# EAGLE design interface_gate (EAGLE 6.6.0)
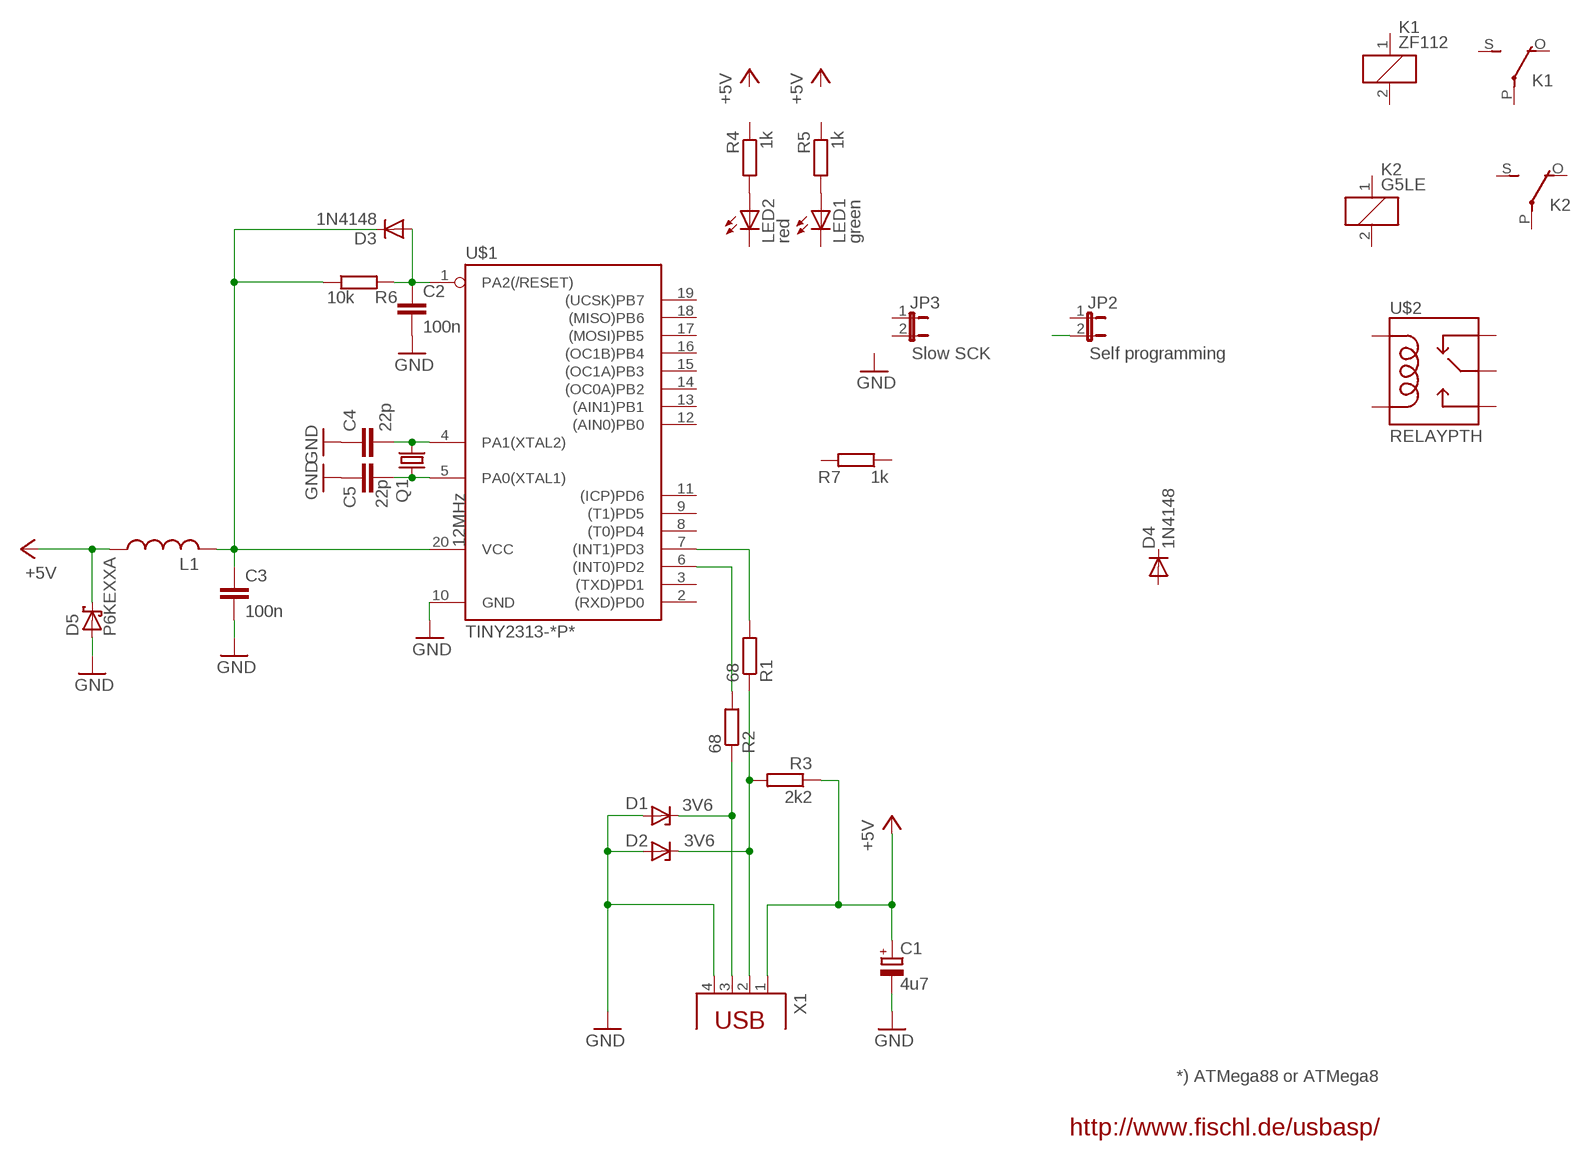
[diagram p0: schematic, sheet 1]

## Parts
C1  4u7  CPOL-EUE2.5-5  [E2,5-5]
C2  100n  C-EU025-024X044  [C025-024X044]
C3  100n  C-EU025-024X044  [C025-024X044]
C4  22p  C-EU025-024X044  [C025-024X044]
C5  22p  C-EU025-024X044  [C025-024X044]
D1  3V6  ZENER-DIODEDO34-7  [DO34Z7]
D2  3V6  ZENER-DIODEDO34-7  [DO34Z7]
D3  1N4148  1N4148DO35-10  [DO35-10]
D4  1N4148  1N4148DO35-10  [DO35-10]
D5  P6KEXXA  [C1702-15]
JP2  Self programming  JP1E  [JP1]
JP3  Slow SCK  JP1E  [JP1]
K1  ZF112  [ZF112]
K2  G5LE  [G5LE]
L1  L-US0207/10  [0207/10]
LED1  green  LED3MM  [LED3MM]
LED2  red  LED3MM  [LED3MM]
Q1  12MHz  CRYTALHC49S  [HC49/S]
R1  68  R-EU_0207/10  [0207/10]
R2  68  R-EU_0207/10  [0207/10]
R3  2k2  R-EU_0207/10  [0207/10]
R4  1k  R-EU_0207/10  [0207/10]
R5  1k  R-EU_0207/10  [0207/10]
R6  10k  R-EU_0207/10  [0207/10]
R7  1k  R-EU_0207/10  [0207/10]
U$1  TINY2313-*P*  [DIL20]
U$2  RELAYPTH  [SRD-05VDC-SL-C]
X1  PN61729  [PN61729]

## Nets
+5V: C1.+ D5.C L1.1 R3.1 X1.1
GND: C1.- C2.2 C3.2 C4.1 C5.1 D1.A D2.A D5.A U$1.10(GND) X1.4
N$1: C2.1 D3.A R6.2 U$1.1(PA2(/RESET))
N$3: C3.1 D3.C L1.2 R6.1 U$1.20(VCC)
N$5: D2.C R1.1 R3.2 X1.2
N$7: R2.2 U$1.6((INT0)PD2)
N$8: D1.C R2.1 X1.3
N$13: LED2.A R4.2
N$16: R1.2 U$1.7((INT1)PD3)
N$19: JP2.2
N$22: C4.2 Q1.2 U$1.4(PA1(XTAL2))
N$23: C5.2 Q1.1 U$1.5(PA0(XTAL1))
N$25: LED1.A R5.2
Unconnected: D4.A D4.C JP2.1 JP3.1 JP3.2 K1.1 K1.2 K1.O(2:O) K1.P(2:P) K1.S(2:S) K2.1 K2.2 K2.O(2:O) K2.P(2:P) K2.S(2:S) LED1.K(C) LED2.K(C) R4.1 R5.1 R7.1 R7.2 U$1.2((RXD)PD0) U$1.3((TXD)PD1) U$1.8((T0)PD4) U$1.9((T1)PD5) U$1.11((ICP)PD6) U$1.12((AIN0)PB0) U$1.13((AIN1)PB1) U$1.14((OC0A)PB2) U$1.15((OC1A)PB3) U$1.16((OC1B)PB4) U$1.17((MOSI)PB5) U$1.18((MISO)PB6) U$1.19((UCSK)PB7) U$2.COIL0 U$2.COIL1 U$2.SWCLOSED(SWCLOSE) U$2.SWCOMMON U$2.SWOPEN

## Notes on the sheet
- *) ATMega88 or ATMega8
- http://www.fischl.de/usbasp/

## Library data of the parts
C1 = rcl:CPOL-EU: POLARIZED CAPACITOR, European symbol
C2-C5 = rcl:C-EU: CAPACITOR, European symbol
D1 D2 = diode:ZENER-DIODE: Z-Diode
D3 D4 = diode:1N4148: DIODE high speed (Philips)
D5 = diode:P6KEXXA: DIODE transient-voltage suppressor
JP2 JP3 = jumper:JP1E: JUMPER
K1 = relay:ZF112: RELAY 1 x switch; OC_FARNELL: unknown; OC_NEWARK: unknown
K2 = relay:G5LE: RELAY 1 x switch, 10 A/120 V AC, 8 A/30 V DC, Omron; OC_FARNELL: unknown; OC_NEWARK: unknown
L1 = rcl:L-US: INDUCTOR, American symbol
LED1 LED2 = led:LED: LED OSRAM: - CHIPLED LG R971, LG N971, LY N971, LG Q971, LY Q971, LO R971, LY R971 LH N974, LH R974 LS Q976, LO Q976, LY Q976 LO Q996 - Hyper CHIPLED LW Q18S LB Q993, LB Q99A, LB R99A - SideLED LS A670, LO A670, LY A670, LG A670, LP A670 LB A673, LV A673, LT A673, LW A673 LH A674 LY A675 LS A676, LA A676, LO A676, LY A676, LW A676 LS A679, LY A679, LG A679 - Hyper Micro SIDELED® LS Y876, LA Y876, LO Y876, LY Y876 LT Y87S - SmartLED LW L88C, LW L88S LB L89C, LB L89S, LG L890 LS L89K, LO L89K, LY L89K LS L896, LA L896, LO L896, LY L896 - TOPLED LS T670, LO T670, LY T670, LG T670, LP T670 LSG T670, LSP T670, LSY T670, LOP T670, LYG T670 LG T671, LOG T671, LSG T671 LB T673, LV T673, LT T673, LW T673 LH T674 LS T676, LA T676, LO T676, LY T676, LB T676, LH T676, LSB T676, LW T676 LB T67C, LV T67C, LT T67C, LS T67K, LO T67K, LY T67K, LW E67C LS E67B, LA E67B, LO E67B, LY E67B, LB E67C, LV E67C, LT E67C LW T67C LS T679, LY T679, LG T679 LS T770, LO T770, LY T770, LG T770, LP T770 LB T773, LV T773, LT T773, LW T773 LH T774 LS E675, LA E675, LY E675, LS T675 LS T776, LA T776, LO T776, LY T776, LB T776 LHGB T686 LT T68C, LB T68C - Hyper Mini TOPLED® LB M676 - Mini TOPLED Santana® LG M470 LS M47K, LO M47K, LY M47K Source: http://www.osram.convergy.de/
Q1 = crystal:CRYTAL: CRYSTAL
R1-R7 = rcl:R-EU_: RESISTOR, European symbol
U$1 = avr-7:TINY2313*: Atmel Tiny2313 2K Flash, 128 bytes EEPROM, 128 bytes RAM
U$2 = SRD-05VDC-SL-C:RELAY: SPDT relay (COM-00101)
X1 = con-berg:PN61729: BERG USB connector

## Board
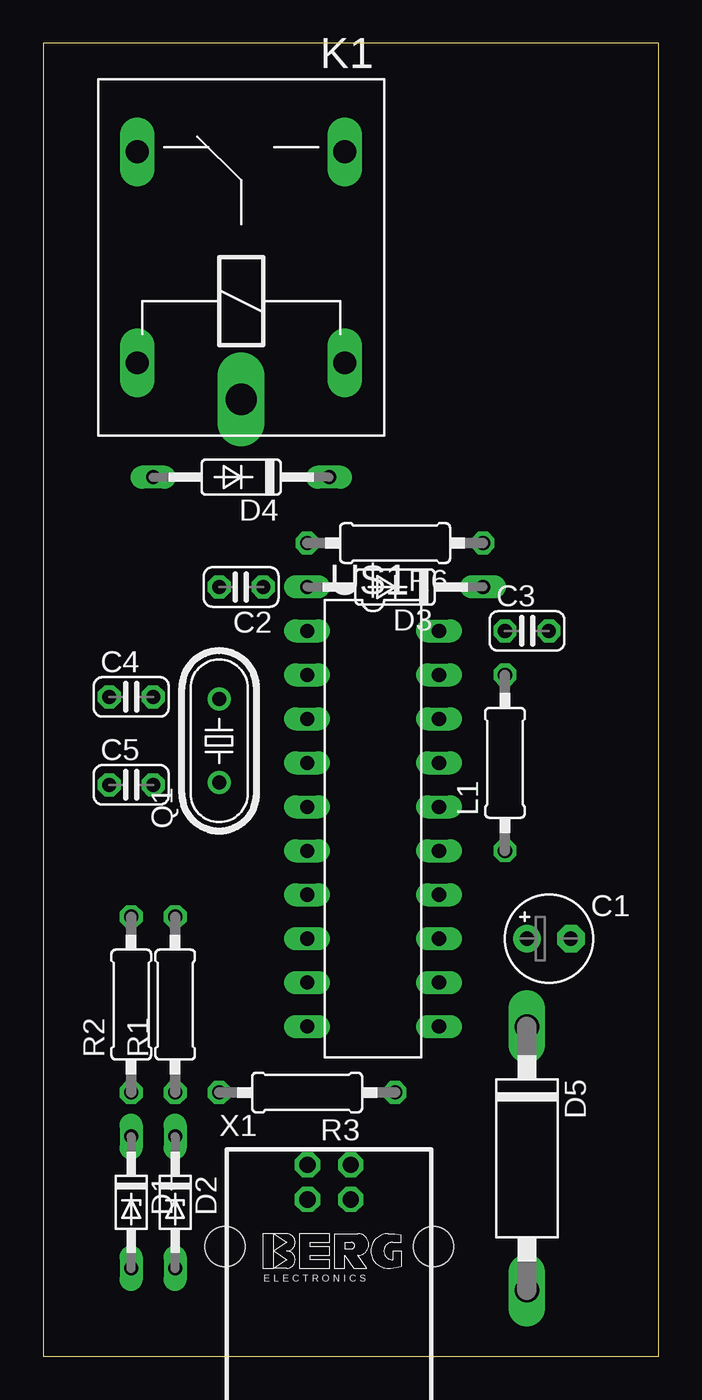
[diagram p1: board, top side]
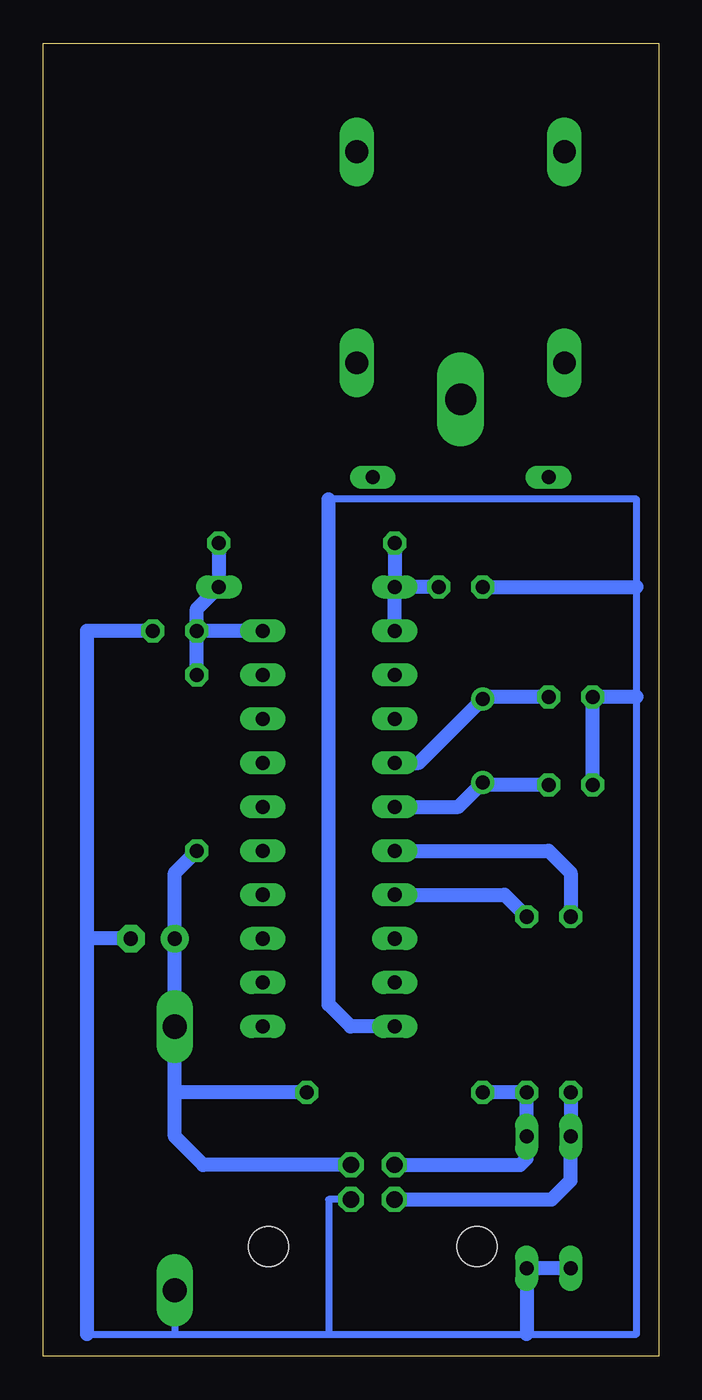
[diagram p2: board, bottom side, seen from below]

Size 35.54 x 75.87 mm. Coordinates in mm from the lower left corner, seen from the top.
Outline: 0,0 35.54,0 35.54,75.87 0,75.87 0,0
Copper layers (1*16): Top 0.035mm / dielectric 1.5mm / Bottom 0.035mm
Design rules "default": minimum track width 10mil, minimum drill 24mil, track to track 8mil, track to pad 8mil, pad to pad 8mil, via to via 8mil, smd to smd 8mil, copper to edge 40mil, drill to drill 8mil, minimum pad ring 10mil, minimum via ring 8mil, stop-mask expansion 4mil, vias tented up to drill 0mil, thermal gap 10mil

### Footprints (pad centres in the part's own frame; a part is rotated, then mirrored left to right if it is on the bottom)
E2,5-5 = drill 0.813 pad 1.6: + -1.27,0 | drill 0.813 pad 1.6 octagon: - 1.27,0
C025-024X044 = drill 0.813 octagon: 1 -1.27,0; 2 1.27,0
DO34Z7 = drill 0.813 long: A 3.81,0; C -3.81,0
DO35-10 = drill 0.813 long: A 5.08,0; C -5.08,0
C1702-15 = drill 1.397 long: A 7.62,0; C -7.62,0
JP1 = drill 0.914 long: 1 0,-1.27; 2 0,1.27
ZF112 = drill 1.321 long: 1 -6.096,5.994; 2 -6.096,-5.994; O 6.096,5.994; S 6.096,-5.994 | drill 1.803 long: P -8.204,0
G5LE = drill 1.321 long: 1 -7.493,-5.969; 2 -7.493,5.969; O 4.699,5.969; P -9.525,0; S 4.699,-5.969
0207/10 = drill 0.813 octagon: 1 -5.08,0; 2 5.08,0
LED3MM = drill 0.813 octagon: A -1.27,0; K 1.27,0
HC49/S = drill 0.813: 1 -2.413,0; 2 2.413,0
DIL20 = drill 0.813 long: 1 -11.43,-3.81; 2 -8.89,-3.81; 3 -6.35,-3.81; 4 -3.81,-3.81; 5 -1.27,-3.81; 6 1.27,-3.81; 7 3.81,-3.81; 8 6.35,-3.81; 9 8.89,-3.81; 10 11.43,-3.81; 11 11.43,3.81; 12 8.89,3.81; 13 6.35,3.81; 14 3.81,3.81; 15 1.27,3.81; 16 -1.27,3.81; 17 -3.81,3.81; 18 -6.35,3.81; 19 -8.89,3.81; 20 -11.43,3.81
SRD-05VDC-SL-C = drill 0.9: COIL0 -5.39,-6.12; COIL1 -5.39,5.88; SWCLOSED 6.61,-6.12; SWCOMMON -7.39,-0.12; SWOPEN 6.61,5.88
PN61729 = drill 0.95 octagon: 1 1.25,4.71; 2 -1.25,4.71; 3 -1.25,2.71; 4 1.25,2.71 | hole 2.3: -6.02,0; 6.02,0

### Placement (x,y rotation side)
C1  29.21,24.13 0 top
C2  11.43,44.45 180 top
C3  27.94,41.91 0 top
C4  5.08,38.1 0 top
C5  5.08,33.02 0 top
D1  5.08,8.89 270 top
D2  7.62,8.89 270 top
D3  20.32,44.45 180 top
D4  11.43,50.8 180 top
D5  27.94,11.43 270 top
JP2  -31.75,3.81 0 top  (outside the outline)
JP3  -46.99,22.86 0 top  (outside the outline)
K1  11.43,63.5 90 top
K2  -41.91,-52.07 0 top  (outside the outline)
L1  26.67,34.29 90 top
LED1  -20.32,60.96 0 top  (outside the outline)
LED2  -30.48,60.96 0 top  (outside the outline)
Q1  10.16,35.56 90 top
R1  7.62,20.32 90 top
R2  5.08,20.32 90 top
R3  15.24,15.24 180 top
R4  -44.45,49.53 0 top  (outside the outline)
R5  -15.24,57.15 0 top  (outside the outline)
R6  20.32,46.99 180 top
R7  -44.45,54.61 0 top  (outside the outline)
U$1  19.05,30.48 270 top
U$2  -44.45,-68.58 0 top  (outside the outline)
X1  16.51,6.35 0 top

### Tracks (layer width: path | path; a pad name or v marks a point on that pad's centre or on a via)
+5V
  Bottom 0.813: X1.1 26.3,11.06 27.94,12.7 27.94,15.24 | 27.94,15.24 D5.C C1.+ 27.94,27.94 L1.1 | R3.1 27.94,15.24
GND
  Bottom 0.406: 19.05,49.53 1.27,49.53 1.27,44.45 1.27,38.1 1.27,1.27 7.62,1.27 19.05,1.27 | 33.02,1.27 27.94,1.27 | 27.94,1.27 19.05,1.27 | X1.4 19.05,9.06 19.05,1.27 | D5.A 27.94,1.27
  Bottom 0.813: D1.A D2.A 7.62,1.27 | U$1.10 17.78,19.05 19.05,20.32 19.05,49.53 | C1.- 33.02,24.13 | 33.02,24.13 33.02,1.27 | C3.2 33.02,41.91 33.02,24.13 | C2.2 1.27,44.45 | C5.1 C4.1 1.27,38.1
N$1
  Bottom 0.813: U$1.1 D3.A | C2.1 D3.A | R6.2 D3.A
N$3
  Bottom 0.813: U$1.20 C3.1 | L1.2 C3.1 | R6.1 D3.C 26.67,43.18 C3.1
N$5
  Bottom 0.813: X1.2 7.99,11.06 7.62,11.43 D2.C R1.1 R3.2
N$7
  Bottom 0.813: U$1.6 6.35,29.21 5.08,27.94 R2.2
N$8
  Bottom 0.813: R2.1 D1.C 5.08,10.16 6.18,9.06 X1.3
N$13  (1 unrouted)
N$16
  Bottom 0.813: U$1.7 8.89,26.67 R1.2
N$22
  Bottom 0.813: U$1.4 13.84,34.29 Q1.2 10.03,38.1 C4.2
N$23
  Bottom 0.813: U$1.5 11.56,31.75 Q1.1 10.03,33.02 C5.2
N$25  (1 unrouted)